# Altium schematic sheet USB2JTAG.SchDoc
size A4
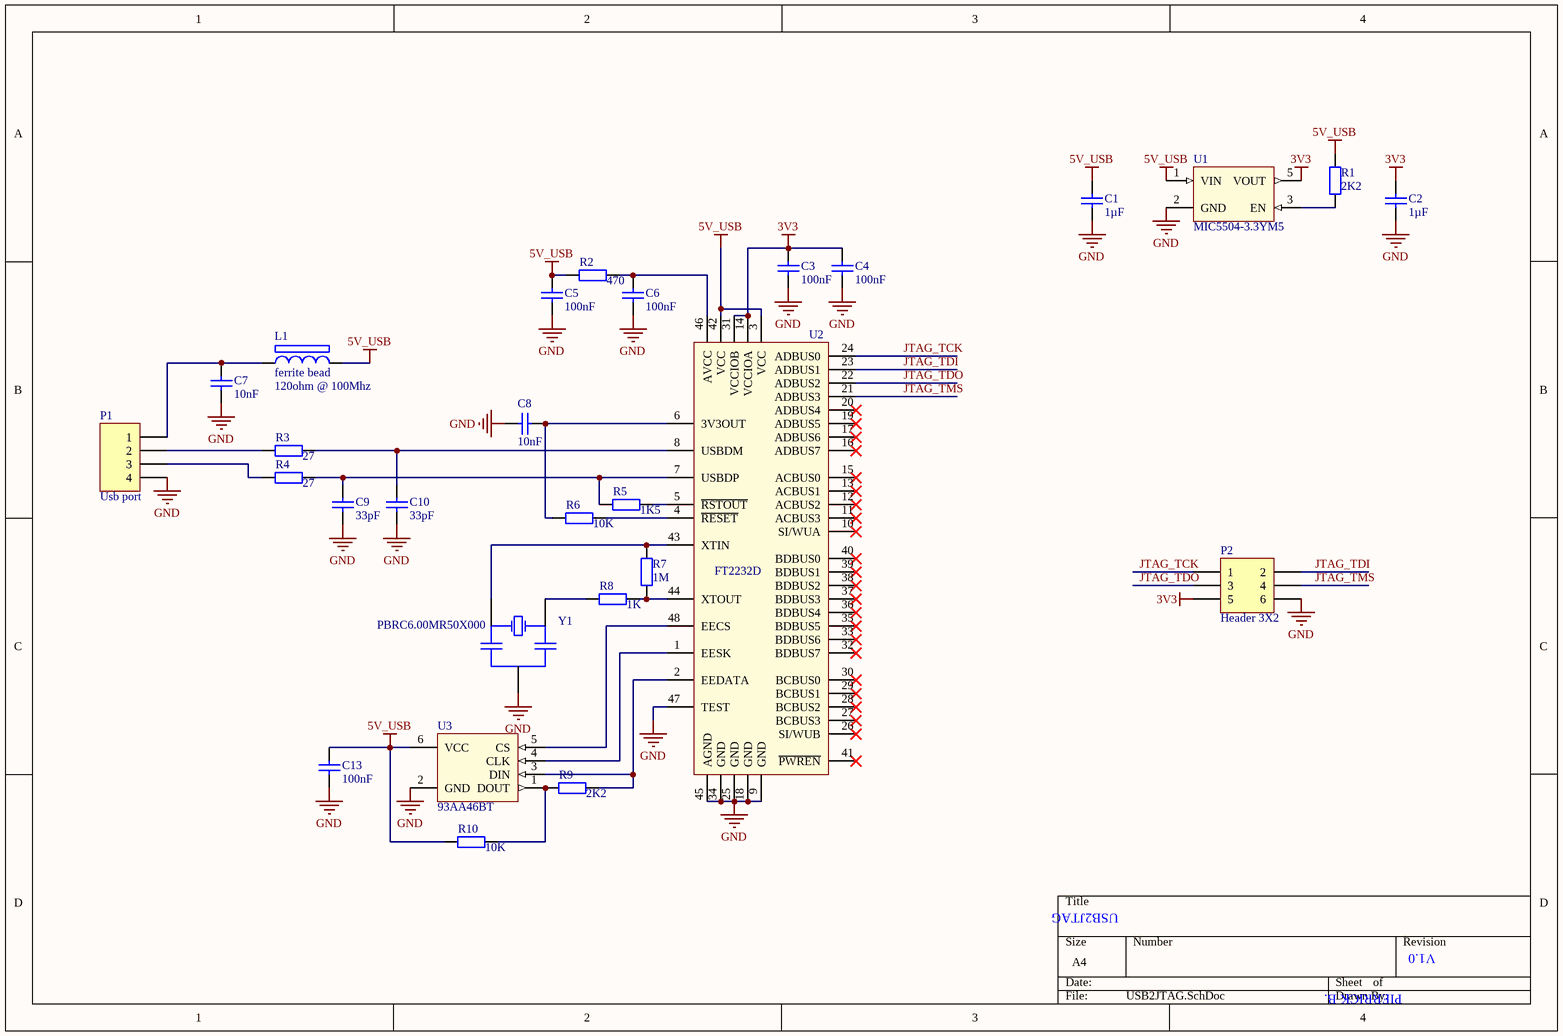
[diagram p0: USB2JTAG.SchDoc]

## Parts
C1  value 1µF  [C0402]  (hidden comment: Cap)
C2  value 1µF  [C0402]  (hidden comment: Cap)
C3  value 100nF  [C0402]  (hidden comment: Cap)
C4  value 100nF  [C0402]  (hidden comment: Cap)
C5  value 100nF  [C0402]  (hidden comment: Cap)
C6  value 100nF  [C0402]  (hidden comment: Cap)
C7  value 10nF  [C0402]  (hidden comment: Cap)
C8  value 10nF  [C0402]  (hidden comment: Cap)
C9  value 33pF  [C0402]  (hidden comment: Cap)
C10  value 33pF  [C0402]  (hidden comment: Cap)
C13  value 100nF  [C0402]  (hidden comment: Cap)
L1  ferrite bead  value 120ohm @ 100Mhz  [0402]
P1  Usb port  [480371000]
P2  Header 3X2  [minitek127-6way]
R1  value 2K2  [0402]  (hidden comment: Res2)
R2  value 470  [0402]  (hidden comment: Res2)
R3  value 27  [0402]  (hidden comment: Res2)
R4  value 27  [0402]  (hidden comment: Res2)
R5  value 1K5  [0402]  (hidden comment: Res2)
R6  value 10K  [0402]  (hidden comment: Res2)
R7  value 1M  [0402]  (hidden comment: Res2)
R8  value 1K  [0402]  (hidden comment: Res2)
R9  value 2K2  [0402]  (hidden comment: Res2)
R10  value 10K  [0402]  (hidden comment: Res2)
U1  MIC5504-3.3YM5  [SOT23-5_M]
U2  FT2232D  [LQFP-48]
U3  93AA46BT  [SOT23-6_M]
Y1  PBRC6.00MR50X000  [PBRC_M]

## Nets
3V3: C2.1 C3.1 C4.1 P2.5 U1.5(VOUT) U2.14(VCCIOA) U2.31(VCCIOB)
5V_USB: C1.1 C5.1 C13.1 L1.2 R1.2 R2.1 R10.1 U1.1(VIN) U2.3(VCC) U2.42(VCC) U3.6(VCC)
GND: C1.2 C2.2 C3.2 C4.2 C5.2 C6.2 C7.2 C8.2 C9.2 C10.2 C13.2 P1.4 P2.6 U1.2(GND) U2.9(GND) U2.18(GND) U2.25(GND) U2.34(GND) U2.45(AGND) U2.47(TEST) U3.2(GND) Y1.2(GND)
JTAG_TCK: P2.1 U2.24(ADBUS0)
JTAG_TDI: P2.2 U2.23(ADBUS1)
JTAG_TDO: P2.3 U2.22(ADBUS2)
JTAG_TMS: P2.4 U2.21(ADBUS3)
NetC6_1: C6.1 R2.2 U2.46(AVCC)
NetC7_1: C7.1 L1.1 P1.1
NetC8_1: C8.1 R6.1 U2.6(3V3OUT)
NetC9_1: C9.1 R4.2 R5.2 U2.7(USBDP)
NetC10_1: C10.1 R3.2 U2.8(USBDM)
NetP1_2: P1.2 R3.1
NetP1_3: P1.3 R4.1
NetR1_1: R1.1 U1.3(EN)
NetR5_1: R5.1 U2.5(~{RSTOUT})
NetR6_2: R6.2 U2.4(~{RESET})
NetR7_1: R7.1 R8.2 U2.44(XTOUT)
NetR7_2: R7.2 U2.43(XTIN) Y1.1(In)
NetR8_1: R8.1 Y1.3(Out)
NetR9_1: R9.1 R10.2 U3.1(DOUT)
NetR9_2: R9.2 U2.2(EEDATA) U3.3(DIN)
NetU2_1: U2.1(EESK) U3.4(CLK)
NetU2_48: U2.48(EECS) U3.5(CS)

Not connected (* = marked no-connect by the designer): U2 10(SI/WUA)* 11(ACBUS3)* 12(ACBUS2)* 13(ACBUS1)* 15(ACBUS0)* 16(ADBUS7)* 17(ADBUS6)* 19(ADBUS5)* 20(ADBUS4)* 26(SI/WUB)* 27(BCBUS3)* 28(BCBUS2)* 29(BCBUS1)* 30(BCBUS0)* 32(BDBUS7)* 33(BDBUS6)* 35(BDBUS5)* 36(BDBUS4)* 37(BDBUS3)* 38(BDBUS2)* 39(BDBUS1)* 40(BDBUS0)* 41(~{PWREN})*

## Notes on the sheet
- USB2JTAG
- PIERRICK B.
- V1.0

## Library data of the parts
C1-C10 C13 = Cap: Capacitor; Published: 8-Jun-2000; LatestRevisionDate: 17-Jul-2002; LatestRevisionNote: Re-released for DXP Platform.; PackageReference: RAD-0.3; Publisher: Altium Limited; Supplier: FARNELL
L1 = ferrite bead: Code_IEC: 1005; Published: 8-Jun-2000; LatestRevisionDate: 17-Jul-2002; LatestRevisionNote: Re-released for DXP Platform.; PackageReference: 0402-A; Publisher: Altium Limited; Code_JEITA: 0402
P2 = Header 3X2: Header, 6-Pin, Dual row; LatestRevisionDate: 17-Jul-2002; LatestRevisionNote: Re-released for DXP Platform.; Publisher: Altium Limited
R1-R10 = Res2: Resistor; Published: 8-Jun-2000; LatestRevisionDate: 17-Jul-2002; LatestRevisionNote: Re-released for DXP Platform.; PackageReference: AXIAL-0.4; Publisher: Altium Limited; Supplier: FARNELL
Y1 = PBRC12.00HR50X0RZ